# Altium schematic sheet RECEIVER_DORJI7020.SchDoc
size A4
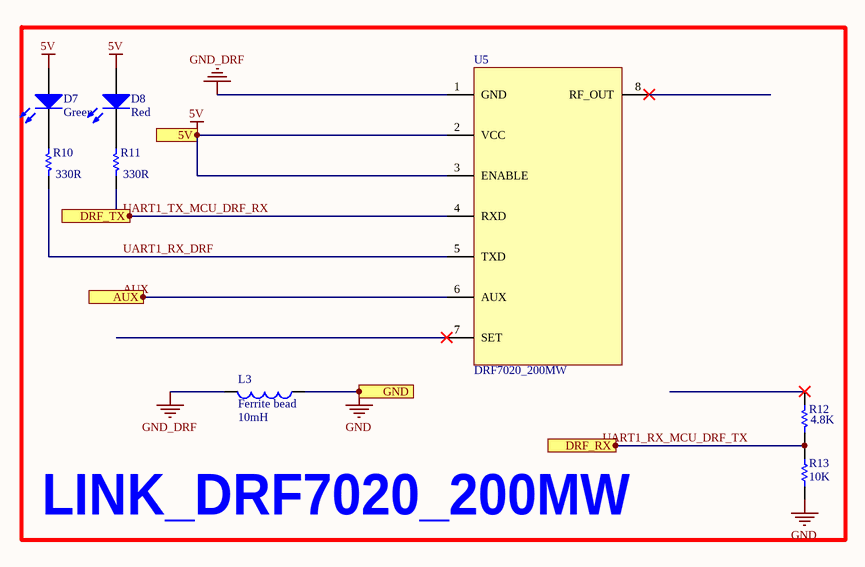
[diagram p0: RECEIVER_DORJI7020.SchDoc]

## Parts
D7  Green  [0603 -LED_GREEN - duplicate]
D8  Red  [0603 -LED_GREEN - duplicate]
L3  Ferrite bead  value 10mH  [0603 - RESISTOR]
R10  330R  [0603 - RESISTOR]
R11  330R  [0603 - RESISTOR]
R12  4.8K  [0603 - RESISTOR]
R13  10K  [0603 - RESISTOR]
U5  DRF7020_200MW  [DRF7020D13_MODULE_200MW]

## Blocks framed on the sheet
LINK_DRF7020_200MW: D7 D8 L3 R10-R13 U5

## Ports
5V, AUX, DRF_RX, DRF_TX, GND

## Nets
5V: D7.1(A) D8.1(A) U5.2(VCC) U5.3(ENABLE) ; port 5V
GND: L3.1 R13.2 ; port GND
GND_DRF: L3.2 U5.1(GND)
AUX: U5.6(AUX) ; port AUX
UART1_RX_DRF: R10.2 U5.5(TXD)
UART1_RX_MCU_DRF_TX: R12.2 R13.1 ; port DRF_RX
UART1_TX_MCU_DRF_RX: R11.2 U5.4(RXD) ; port DRF_TX
NetD7_2: D7.2(K) R10.1
NetD8_2: D8.2(K) R11.1

Not connected (* = marked no-connect by the designer): R12 1*; U5 7(SET)* 8(RF_OUT)*

## Library data of the parts
D7 D8 = LED0: Typical INFRARED GaAs LED; Published: 8-Jun-2000; LatestRevisionDate: 08-Jul-2005; LatestRevisionNote: Mech Layer 1 removed.; PackageReference: LED-0; Publisher: Altium Limited; PackageDescription: LED; 2 Leads
L3 = Inductor: Code_IEC: 1005; Published: 8-Jun-2000; LatestRevisionDate: 29-May-2009; LatestRevisionNote: IPC-7351 Footprint Added.; PackageReference: 0402-A; Publisher: Altium Limited; PackageDescription: Chip Inductor; Code_JEITA: 0402
R10-R12 = Res1: Resistor; Published: 8-Jun-2000; LatestRevisionDate: 17-Jul-2002; LatestRevisionNote: Re-released for DXP Platform.; PackageReference: AXIAL-0.3; Publisher: Altium Limited; PackageDescription: Axial Device, Thru-Hole; 2 Leads; 0.3 in Pin Spacing
  R10 R11: Value: 330R
  R12: Value: 4.8K
R13 = Res Semi: Semiconductor Resistor; Published: 8-Jun-2000; LatestRevisionDate: 17-Jul-2002; LatestRevisionNote: Re-released for DXP Platform.; PackageReference: AXIAL-0.5; Publisher: Altium Limited; Value: 10k